# EAGLE schematic ESP8266 Relay (EAGLE 9.6.2)
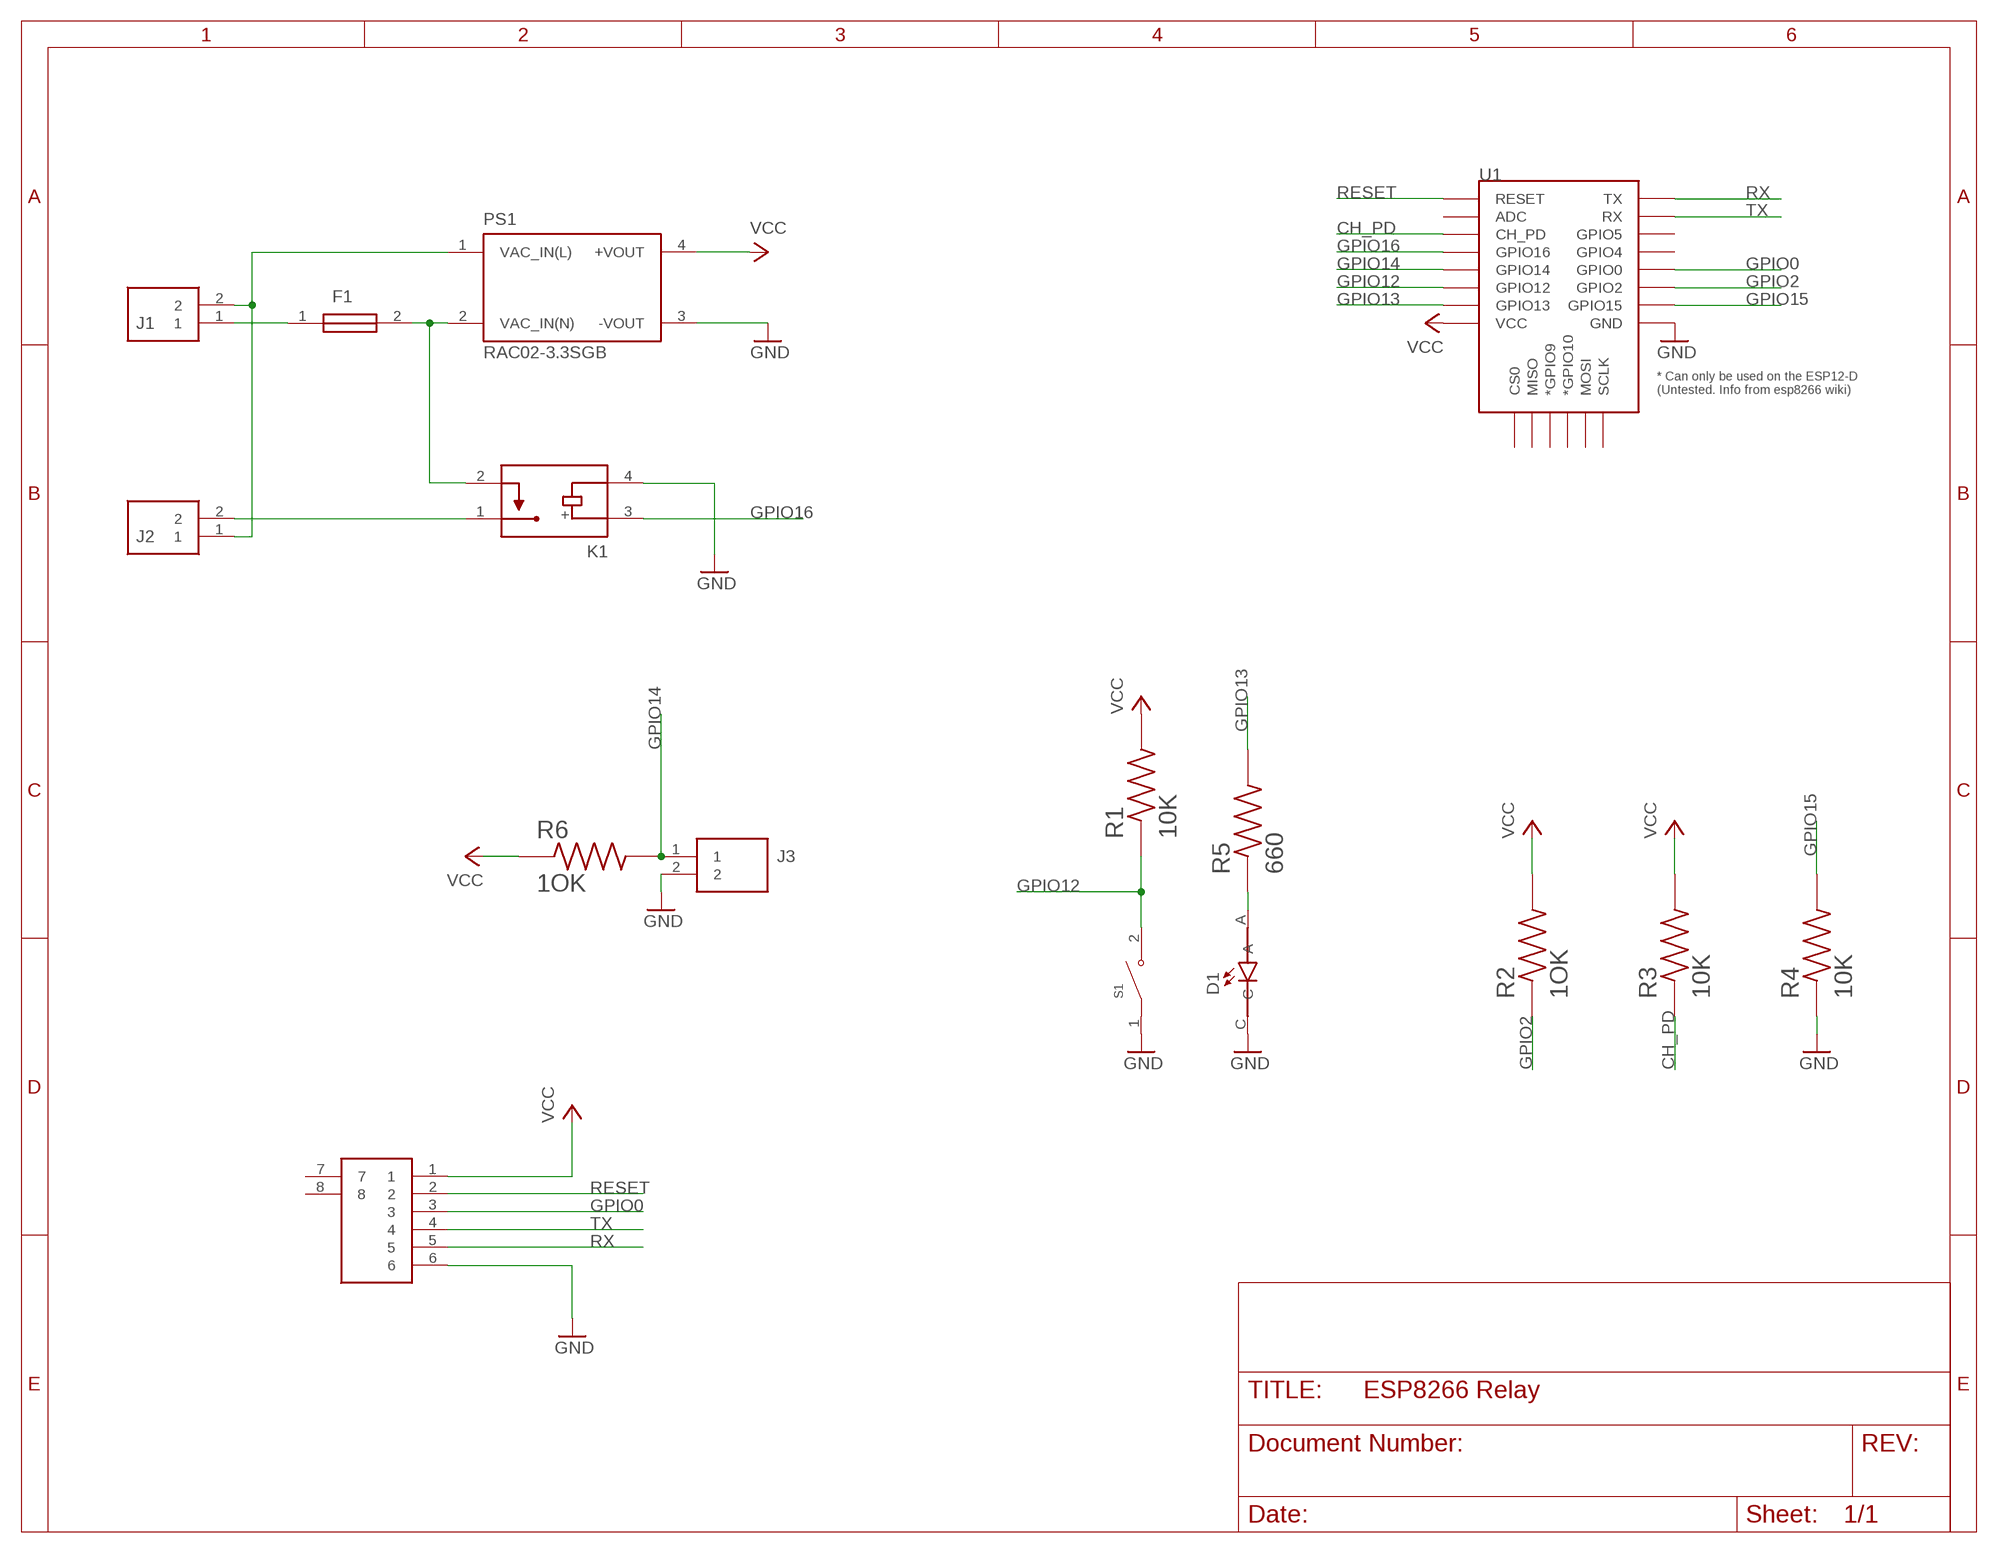
[diagram p0: schematic, sheet 1]

## Parts
D1  SML-LXT0805IW-TR  [LEDC2012X120N]
F1  3404.2469.22  [3404246922]
J1  TB006-508-02BE  [TB00650802BE]
J2  TB006-508-02BE  [TB00650802BE]
J3  TB006-508-02BE  [TB00650802BE]
J4  52852-0670  [528520670]
K1  G3MB-202PDC5  [RELAY_G3MB-202PDC5]
PS1  RAC02-3.3SGB  [CONV_RAC02-3.3SGB]
R1  10K  RC0805FR-07330RL  [RESC2012X60N]
R2  1OK  RC0805FR-07330RL  [RESC2012X60N]
R3  10K  RC0805FR-07330RL  [RESC2012X60N]
R4  10K  RC0805FR-07330RL  [RESC2012X60N]
R5  660  RC0805FR-07330RL  [RESC2012X60N]
R6  1OK  RC0805FR-07330RL  [RESC2012X60N]
S1  PTS636_SM43J_SMTR_LFS  [SW_PTS636_SM43J_SMTR_LFS]
U1  ESP12ESMD  [ESP12E-SMD]

## Nets
CH_PD: R3.1 U1.CH_PD
GND: D1.C J3.2 J4.6 K1.4 PS1.3(-VOUT) R4.1 S1.1(COM) U1.GND
GPIO0: J4.3 U1.GPIO0
GPIO2: R2.1 U1.GPIO2
GPIO12: R1.1 S1.2(NO) U1.GPIO12
GPIO13: R5.2 U1.GPIO13
GPIO14: J3.1 R6.2 U1.GPIO14
GPIO15: R4.2 U1.GPIO15
GPIO16: K1.3 U1.GPIO16
N$1: F1.2 K1.2 PS1.2(VAC_IN(N))
N$2: F1.1 J1.1
N$3: J1.2 J2.1 PS1.1(VAC_IN(L))
N$4: J2.2 K1.1
N$9: D1.A R5.1
RESET: J4.2 U1.RESET
RX: J4.5 U1.TXD0(TX)
TX: J4.4 U1.RXD0(RX)
VCC: J4.1 PS1.4(+VOUT) R1.2 R2.2 R3.2 R6.1 U1.VCC
Unconnected: J4.7 J4.8 U1.ADC U1.CS0 U1.GPIO4 U1.GPIO5 U1.GPIO9(*GPIO9) U1.GPIO10(*GPIO10) U1.MISO U1.MOSI U1.SCLK

## Library data of the parts
D1 = SML-LXT0805IW-TR:SML-LXT0805IW-TR: LED; Luminous Intensity:11µcd; Viewing Angle:140°; Forward Current:30mA; Forward Voltage:2V; Color:Red; LED Color:Red; Leaded Process Compatible:Yes; Lens Color:White; Mounting Type:Surface Mount ;RoHS Compliant: Yes Check availability <https://pricing.snapeda.com/parts/SML-LXT0805IW-TR/Lumex%20Opto/Components/view-part?ref=eda>; AVAILABILITY: In Stock; DESCRIPTION: Red - LED Indication - Discrete 2V 0805 (2012 Metric); MF: Lumex Opto/Components; MP: SML-LXT0805IW-TR; PACKAGE: 0805 Lumex; PRICE: None; PURCHASE-URL: https://pricing.snapeda.com/search/part/SML-LXT0805IW-TR/?ref=eda
F1 = 3404.2469.22:3404.2469.22: 2 A 250 V AC 125 V DC Fuse Board Mount (Cartridge Style Excluded) Surface Mount 2-SMD, Square End Block with Clip Source: Datasheet <https://componentsearchengine.com/Datasheets/1/3404.2469.22.pdf>; DESCRIPTION: 2 A 250 V AC 125 V DC Fuse Board Mount (Cartridge Style Excluded) Surface Mount 2-SMD, Square End Block with Clip; HEIGHT: 4mm; MANUFACTURER_NAME: SCHURTER; MANUFACTURER_PART_NUMBER: 3404.2469.22; MOUSER_PART_NUMBER: 693-3404.2469.22; MOUSER_PRICE-STOCK: https://www.mouser.com/Search/Refine.aspx?Keyword=693-3404.2469.22
J1-J3 = TB006-508-02BE:TB006-508-02BE: Fixed Terminal Blocks screw type, 5.08 , horizontal, 2 poles, CUI Blue, slotted screw, PCB mount Source: Datasheet; DESCRIPTION: Fixed Terminal Blocks screw type, 5.08 , horizontal, 2 poles, CUI Blue, slotted screw, PCB mount; HEIGHT: 10.4mm; MANUFACTURER_NAME: CUI Inc.; MANUFACTURER_PART_NUMBER: TB006-508-02BE; MOUSER_PART_NUMBER: 490-TB006-508-02BE; MOUSER_PRICE-STOCK: https://www.mouser.co.uk/ProductDetail/CUI-Devices/TB006-508-02BE?qs=vLWxofP3U2wEdOVV%2FaT04w%3D%3D
J4 = 52852-0670:52852-0670: FFC & FPC Connectors 1.0 FFC Non ZIF SMT HsgAssy6CktEmbsTpPkg Source: Datasheet <https://www.molex.com/pdm_docs/sd/528520670_sd.pdf>; DESCRIPTION: FFC & FPC Connectors 1.0 FFC Non ZIF SMT HsgAssy6CktEmbsTpPkg; HEIGHT: 3mm; MANUFACTURER_NAME: Molex; MANUFACTURER_PART_NUMBER: 52852-0670; MOUSER_PART_NUMBER: 538-52852-0670; MOUSER_PRICE-STOCK: https://www.mouser.co.uk/ProductDetail/Molex/52852-0670?qs=%252BdbFUiYBkDZQc5IPgvIwgQ%3D%3D
K1 = G3MB-202PDC5:G3MB-202PDC5: Check prices <https://pricing.snapeda.com/parts/G3MB-202P%20DC5/Omron%20Automation/view-part?ref=eda>; AVAILABILITY: Not in stock; DESCRIPTION: Solid State SPST-NO (1 Form A) 4-SIP; MF: Omron Automation; MP: G3MB-202P DC5; PACKAGE: SIP-4 Omron Automation; PRICE: None
PS1 = RAC02-3.3SGB:RAC02-3.3SGB: AC/DC Converter, 2 Watt, Single Output, EMC Class B Check prices <https://pricing.snapeda.com/parts/RAC02-3.3SGB/Recom%20Power/view-part?ref=eda>; DESCRIPTION: 2W AC/DC-Converter 'POWERLINE' 3kV reg; MF: Recom Power; MP: RAC02-3.3SGB; PACKAGE: DIP-4 Recom Power; PRICE: None
R1-R6 = RC0805FR-07330RL:RC0805FR-07330RL: Resistor SMD [YAGEO] RC0805FR-07330RL Resistor SMD Check availability <https://pricing.snapeda.com/parts/RC0805FR-07330RL/Yageo/view-part?ref=eda>; AVAILABILITY: In Stock; DESCRIPTION: 330 Ohms ±1% 0.125W, 1/8W Chip Resistor 0805 (2012 Metric) Moisture Resistant Thick Film; MF: Yageo; MP: RC0805FR-07330RL; PACKAGE: 2012 Rohm Semiconductor; PRICE: None; PURCHASE-URL: https://pricing.snapeda.com/search/part/RC0805FR-07330RL/?ref=eda
S1 = PTS636_SM43J_SMTR_LFS:PTS636_SM43J_SMTR_LFS: Tactile Switch SPST-NO Top Actuated Surface Mount Check availability <https://pricing.snapeda.com/parts/PTS636%20SM43J%20SMTR%20LFS/C%26K/view-part?ref=eda>; AVAILABILITY: In Stock; DESCRIPTION: Tactile Switch SPST-NO Top Actuated Surface Mount; MF: C&K; MP: PTS636 SM43J SMTR LFS; PACKAGE: None; PRICE: None; PURCHASE-URL: https://pricing.snapeda.com/search/part/PTS636 SM43J SMTR LFS/?ref=eda
U1 = esp8266modules:ESP12E: ESP12E Module